# EAGLE design LPC_2TE_3.5 (EAGLE 5.02)
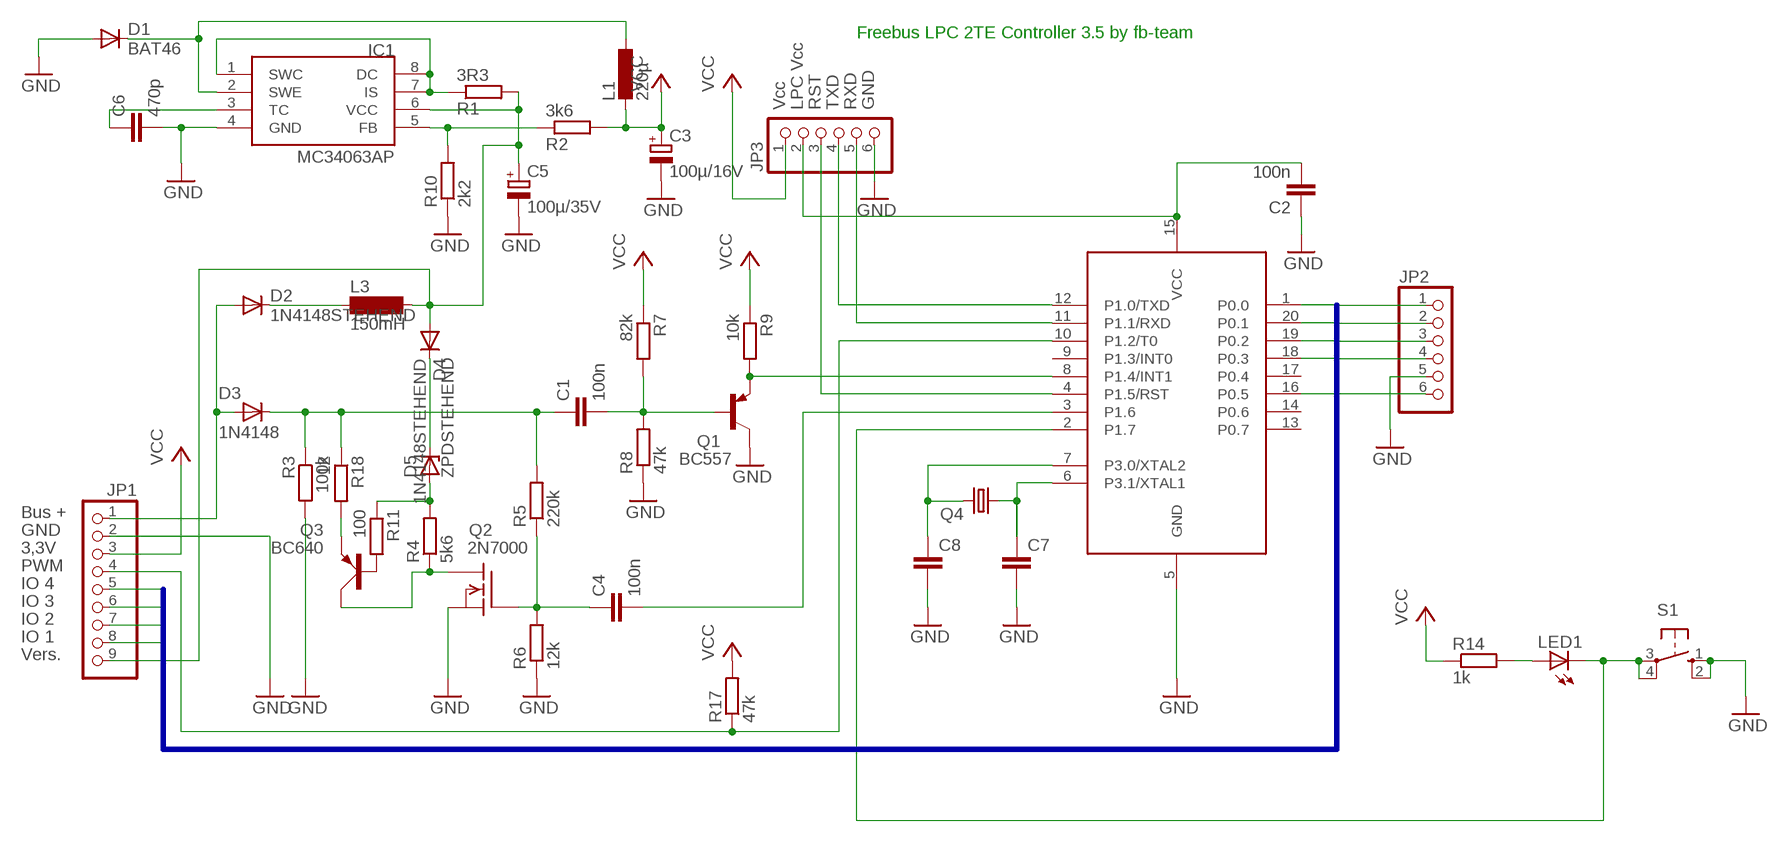
[diagram p0: schematic, sheet 1]

## Parts
C1  100n  C-EU025-024X044  [C025-024X044]
C2  100n  C-EU050-024X044  [C050-024X044]
C3  100µ/16V  CPOL-EUE3.5-8  [E3,5-8]
C4  100n  C-EU025-024X044  [C025-024X044]
C5  100µ/35V  CPOL-EUE3.5-8  [E3,5-8]
C6  470p  C-EU025-024X044  [C025-024X044]
C7  C-EU025-024X044  [C025-024X044]
C8  C-EU025-024X044  [C025-024X044]
D1  BAT46  BAT81  [DO34-7]
D2  1N4148STEHEND  [D-2.5]
D3  1N4148  DO35-STEHEND  [DO35-S]
D4  1N4148STEHEND  [D-2.5]
D5  ZPDSTEHEND  [ZDIODE]
IC1  MC34063AP  [DIL08]
JP1  PINHD-1X9  [1X09]
JP2  PINHD-1X6  [1X06]
JP3  PINHD-1X6  [1X06]
L1  220µ  L-EU0207/2V  [0207/2V]
L3  150mH  BS11  [BS11]
LED1  LED3MM  [LED3MM]
Q1  BC557  [TO92]
Q2  2N7000  VN2222KM  [TO237]
Q3  BC640  [SOT54D]
Q4  CRYSTALHC49S  [HC49/S]
R1  3R3  R-EU_0207/2V  [0207/2V@1]
R2  3k6  R-EU_0207/2V  [0207/2V@1]
R3  100k  R-EU_0207/2V  [0207/2V@1]
R4  5k6  R-EU_0207/2V  [0207/2V@1]
R5  220k  R-EU_0207/2V  [0207/2V@1]
R6  12k  R-EU_0207/2V  [0207/2V@1]
R7  82k  R-EU_0207/2V  [0207/2V@1]
R8  47k  R-EU_0207/2V  [0207/2V@1]
R9  10k  R-EU_0207/2V  [0207/2V@1]
R10  2k2  R-EU_0207/2V  [0207/2V@1]
R11  100  R-EU_0207/2V  [0207/2V@1]
R14  1k  R-EU_0207/2V  [0207/2V@1]
R17  47k  R-EU_0207/2V  [0207/2V@1]
R18  12  R-EU_0207/2V  [0207/2V@1]
S1  10-XX  [B3F-10XX]
U1  89LPC922  [DIL20]

## Nets
EIB+: D2.A D3.P$1(A) JP1.1
GND: C2.1 C3.- C5.- C6.2 C7.2 C8.2 D1.A IC1.4(GND) JP1.2 JP2.5 JP3.6 Q1.3(C) Q2.3(S) R3.2 R6.1 R8.1 R10.1 S1.1(S) S1.2(S1) U1.5(GND)
N$1: Q1.1(E) R9.2 U1.8(P1.4/INT1)
N$2: C1.2 Q1.2(B) R7.2 R8.2
N$3: C8.1 Q4.2 U1.7(P3.0/XTAL2)
N$4: C1.1 D3.P$2(B) R3.1 R5.2 R18.1
N$5: C4.2 U1.3(P1.6)
N$6: C7.1 Q4.1 U1.6(P3.1/XTAL1)
N$7: LED1.K(C) S1.3(P) S1.4(P1) U1.2(P1.7)
N$8: IC1.1(SWC) IC1.7(IS) IC1.8(DC) R1.1
N$9: LED1.A R14.2
N$10: C5.+ D4.A IC1.6(VCC) JP1.9 L3.2 R1.2
N$11: IC1.5(FB) R2.1 R10.2
N$12: D1.C IC1.2(SWE) L1.1
N$13: D2.C L3.1
N$14: C6.1 IC1.3(TC)
N$15: D4.C D5.C
N$25: D5.A R4.2 R11.1
N$26: Q2.1(D) Q3.C R4.1
N$28: Q3.B R11.2
N$29: JP3.4 U1.12(P1.0/TXD)
N$30: JP3.5 U1.11(P1.1/RXD)
N$31: JP3.3 U1.4(P1.5/RST)
N$32: C2.2 JP3.2 U1.15(VCC)
N$33: Q3.E R18.2
N$34: C4.1 Q2.2(G) R5.1 R6.2
N$42: JP2.6 U1.16(P0.5)
P0.0: JP1.8 JP2.1 U1.1(P0.0)
P0.1: JP1.7 JP2.2 U1.20(P0.1)
P0.2: JP1.6 JP2.3 U1.19(P0.2)
P0.3: JP1.5 JP2.4 U1.18(P0.3)
PWM: JP1.4 R17.1 U1.10(P1.2/T0)
VCC: C3.+ JP1.3 JP3.1 L1.2 R2.2 R7.1 R9.1 R14.1 R17.2
Unconnected: U1.9(P1.3/INT0) U1.13(P0.7) U1.14(P0.6) U1.17(P0.4)

## Buses
P0.[0..3]

## Notes on the sheet
- Freebus LPC 2TE Controller 3.5 by fb-team
- Vcc | LPC Vcc | RST | TXD | RXD | GND
- Bus +
- GND
- 3,3V
- PWM
- IO 4
- IO 3
- IO 2
- IO 1
- Vers.

## Library data of the parts
C1 C2 C4 C6-C8 = rcl:C-EU: CAPACITOR, European symbol
C3 C5 = rcl:CPOL-EU: POLARIZED CAPACITOR, European symbol
D1 = diode:BAT81: DIODE barrier diode
D2 D4 = diode:1N4148: DIODE high speed (Philips)
D3 = kubi:DO35-STEHEND
D5 = diode:ZPD: Z DIODE 500 mW
IC1 = mc34063:MC34063
JP1 = pinhead:PINHD-1X9: PIN HEADER
JP2 JP3 = pinhead:PINHD-1X6: PIN HEADER
L1 = rcl:L-EU: INDUCTOR, European symbol
L3 = inductor-neosid:BS: INDUCTOR nominal inductance, magnetically screened
LED1 = led:LED: LED OSRAM: - CHIPLED LG R971, LG N971, LY N971, LG Q971, LY Q971, LO R971, LY R971 LH N974, LH R974 LS Q976, LO Q976, LY Q976 LO Q996 - Hyper CHIPLED LW Q18S LB Q993, LB Q99A, LB R99A - SideLED LS A670, LO A670, LY A670, LG A670, LP A670 LB A673, LV A673, LT A673, LW A673 LH A674 LY A675 LS A676, LA A676, LO A676, LY A676, LW A676 LS A679, LY A679, LG A679 - Hyper Micro SIDELED® LS Y876, LA Y876, LO Y876, LY Y876 LT Y87S - SmartLED LW L88C, LW L88S LB L89C, LB L89S, LG L890 LS L89K, LO L89K, LY L89K LS L896, LA L896, LO L896, LY L896 - TOPLED LS T670, LO T670, LY T670, LG T670, LP T670 LSG T670, LSP T670, LSY T670, LOP T670, LYG T670 LG T671, LOG T671, LSG T671 LB T673, LV T673, LT T673, LW T673 LH T674 LS T676, LA T676, LO T676, LY T676, LB T676, LH T676, LSB T676, LW T676 LB T67C, LV T67C, LT T67C, LS T67K, LO T67K, LY T67K, LW E67C LS E67B, LA E67B, LO E67B, LY E67B, LB E67C, LV E67C, LT E67C LW T67C LS T679, LY T679, LG T679 LS T770, LO T770, LY T770, LG T770, LP T770 LB T773, LV T773, LT T773, LW T773 LH T774 LS E675, LA E675, LY E675, LS T675 LS T776, LA T776, LO T776, LY T776, LB T776 LHGB T686 LT T68C, LB T68C - Hyper Mini TOPLED® LB M676 - Mini TOPLED Santana® LG M470 LS M47K, LO M47K, LY M47K Source: http://www.osram.convergy.de - LUMILED® LXK2-PW12-R00, LXK2-PW12-S00, LXK2-PW14-U00, LXK2-PW14-V00 LXK2-PM12-R00, LXK2-PM12-S00, LXK2-PM14-U00 LXK2-PE12-Q00, LXK2-PE12-R00, LXK2-PE12-S00, LXK2-PE14-T00, LXK2-PE14-U00 LXK2-PB12-K00, LXK2-PB12-L00, LXK2-PB12-M00, LXK2-PB14-N00, LXK2-PB14-P00, LXK2-PB14-Q00 LXK2-PR12-L00, LXK2-PR12-M00, LXK2-PR14-Q00, LXK2-PR14-R00 LXK2-PD12-Q00, LXK2-PD12-R00, LXK2-PD12-S00 LXK2-PH12-R00, LXK2-PH12-S00 LXK2-PL12-P00, LXK2-PL12-Q00, LXK2-PL12-R00 Source: www.luxeon.com
Q1 = transistor-pnp:BC557: PNP Transistor
Q2 = transistor-fet:VN2222KM: N-Channel Enhancement MOSFET (VMOS); 60V; 0,5A; 7,5Ohm
Q3 = transistor-small-signal:BC640: PNP TRANSISTOR
Q4 = crystal:CRYSTAL: CRYSTAL
R1-R11 R14 R17 R18 = rcl:R-EU_: RESISTOR, European symbol
S1 = switch-omron:10-XX: OMRON SWITCH
U1 = micro-philips:89LPC922

## Board
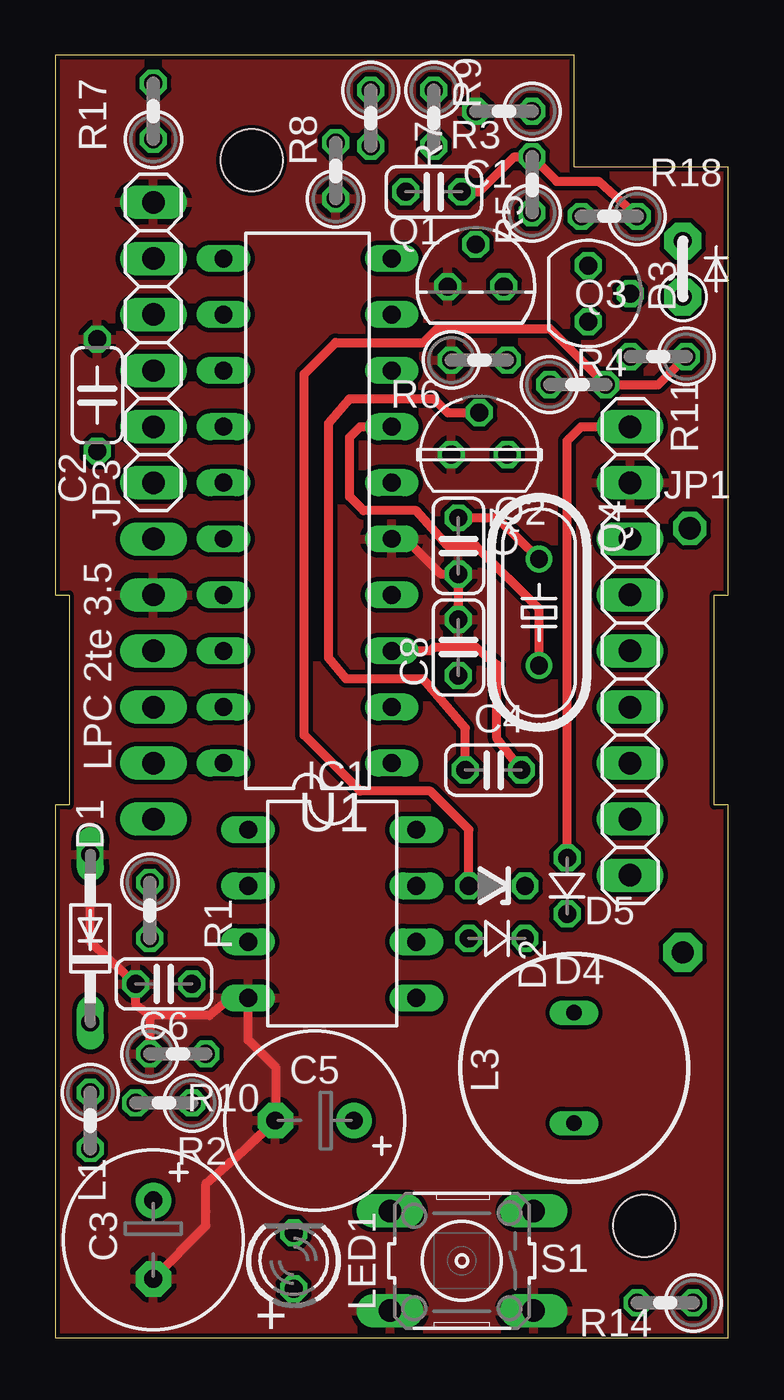
[diagram p1: board, top side]
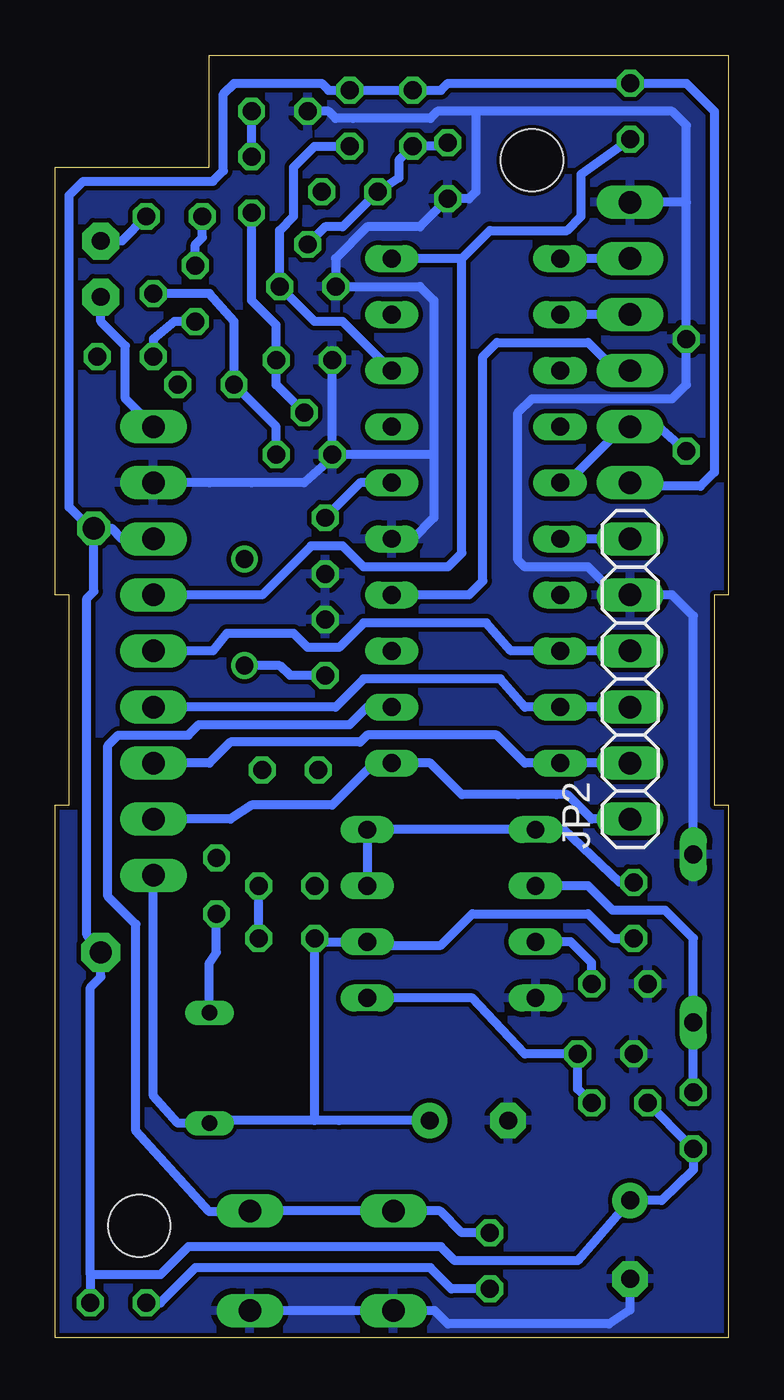
[diagram p2: board, bottom side, seen from below]

Size 30.48 x 58.1 mm. Coordinates in mm from the lower left corner, seen from the top.
Outline: 0,0 30.48,0 30.48,24.13 29.84,24.13 29.84,33.66 30.48,33.66 30.48,53.02 23.49,53.02 23.49,58.1 0,58.1 0,33.66 0.63,33.66 0.63,24.13 0,24.13 0,0
Copper layers (1*16): Top 0.035mm / dielectric 1.5mm / Bottom 0.035mm
Design rules "ZWILLING": minimum track width 0.2mm, minimum drill 0.5mm, track to track 0.2mm, track to pad 0.2mm, pad to pad 0.2mm, via to via 0.2mm, smd to smd 0mil, copper to edge 0.2mm, drill to drill 0.2mm, minimum pad ring 0.2mm, minimum via ring 0.2mm, stop-mask expansion 0.1mm, vias tented up to drill 0mil, thermal gap 10mil
Holes 2.8 mm at 26.67,5.08 8.89,53.34

### Footprints (pad centres in the part's own frame; a part is rotated, then mirrored left to right if it is on the bottom)
C025-024X044 = drill 0.813 octagon: 1 -1.27,0; 2 1.27,0
C050-024X044 = drill 0.813 octagon: 1 -2.54,0; 2 2.54,0
E3,5-8 = drill 0.813 pad 1.6 round: + -1.778,0 | drill 0.813 pad 1.6 octagon: - 1.778,0
DO34-7 = drill 0.813 long: A 3.81,0; C -3.81,0
D-2.5 = drill 0.813 octagon: A 1.27,0; C -1.27,0
DO35-S = drill 0.8 pad 1.676 octagon: P$1 -1.27,0; P$2 1.27,0
ZDIODE = drill 0.813 octagon: A 1.27,0; C -1.27,0
DIL08 = drill 0.813 long: 1 -3.81,-3.81; 2 -1.27,-3.81; 3 1.27,-3.81; 4 3.81,-3.81; 5 3.81,3.81; 6 1.27,3.81; 7 -1.27,3.81; 8 -3.81,3.81
1X09 = drill 1.016 long: 1 -10.16,0; 2 -7.62,0; 3 -5.08,0; 4 -2.54,0; 5 0,0; 6 2.54,0; 7 5.08,0; 8 7.62,0; 9 10.16,0
1X06 = drill 1.016 long: 1 -6.35,0; 2 -3.81,0; 3 -1.27,0; 4 1.27,0; 5 3.81,0; 6 6.35,0
0207/2V = drill 0.813 octagon: 1 -1.27,0; 2 1.27,0
BS11 = drill 0.7 long: 1 -2.5,0; 2 2.5,0
LED3MM = drill 0.813 octagon: A -1.27,0; K 1.27,0
TO92 = drill 0.813 octagon: 1 1.27,0; 2 0,1.905; 3 -1.27,0
TO237 = drill 0.813 octagon: 1 1.27,0; 2 0,1.905; 3 -1.27,0
SOT54D = drill 0.813 octagon: B 1.27,0; C 0,1.905; E -1.27,0
HC49/S = drill 0.813 round: 1 -2.413,0; 2 2.413,0
0207/2V@1 = drill 0.813 octagon: 1 -1.27,0; 2 1.27,0
B3F-10XX = drill 1.016 long: 1 -3.251,2.261; 2 3.251,2.261; 3 -3.251,-2.261; 4 3.251,-2.261
DIL20 = drill 0.813 long: 1 -11.43,-3.81; 2 -8.89,-3.81; 3 -6.35,-3.81; 4 -3.81,-3.81; 5 -1.27,-3.81; 6 1.27,-3.81; 7 3.81,-3.81; 8 6.35,-3.81; 9 8.89,-3.81; 10 11.43,-3.81; 11 11.43,3.81; 12 8.89,3.81; 13 6.35,3.81; 14 3.81,3.81; 15 1.27,3.81; 16 -1.27,3.81; 17 -3.81,3.81; 18 -6.35,3.81; 19 -8.89,3.81; 20 -11.43,3.81

### Placement (x,y rotation side)
C1  17.15,51.91 180 top
C2  1.91,42.7 270 top
C3  4.45,4.44 270 top
C4  19.84,25.72 0 top
C5  11.75,9.84 180 top
C6  4.92,16.03 180 top
C7  18.26,35.88 270 top
C8  18.26,31.27 90 top
D1  1.59,18.1 90 top
D2  23.18,20.48 90 top
D3  28.42,48.42 90 top
D4  20,18.1 180 top
D5  20,20.48 180 top
IC1  12.54,19.21 270 top
JP1  26.04,31.11 270 top
JP2  4.45,29.85 90 bottom
JP3  4.45,45.08 90 top
L1  1.59,9.84 270 top
L3  23.49,12.22 270 top
LED1  10.8,3.49 90 top
Q1  19.05,47.62 0 top
Q2  19.21,40 0 top
Q3  24.13,47.31 270 top
Q4  21.91,32.86 270 top
R1  4.29,19.37 270 top
R2  4.92,10.64 180 top
R3  20.32,55.56 180 top
R4  23.65,43.18 0 top
R5  21.59,52.23 90 top
R6  19.21,44.29 0 top
R7  14.29,55.24 270 top
R8  12.7,52.86 90 top
R9  17.15,55.24 270 top
R10  5.56,12.86 0 top
R11  27.3,44.45 180 top
R14  27.62,1.59 180 top
R17  4.45,55.56 90 top
R18  25.08,50.8 180 top
S1  18.42,3.49 180 top
U1  11.43,37.47 90 top

### Tracks (layer width: path | path; a pad name or v marks a point on that pad's centre or on a via)
EIB+
  Top 0.406: JP1.1 23.81,41.28 23.18,40.64 23.18,24.77 D2.A
  Bottom 0.406: D3.P$1 28.42,46.04 27.3,44.93 27.3,42.55 JP1.1
GND
  Top 0.406: U1.5 15.88,36.2 17.46,34.61 C7.2 C8.2 | 8.26,8.26 C5.- | 8.26,8.26 6.83,6.99 6.83,5.72 6.83,5.08 C3.- | 8.26,8.26 10,9.84 10,12.22 8.73,13.49 IC1.4 | D1.A | C6.2 1.59,17.94 D1.A | C6.2 | 4.29,14.61 3.65,15.08 C6.2 | R10.1 | 4.29,14.61 R10.1 | 4.29,14.61 6.98,14.61 7.94,15.4 IC1.4 | IC1.4 | IC1.4
  Bottom 0.406: 13.33,40.01 Q2.3 | 13.33,40.01 13.33,46.99 13.97,47.63 Q1.3 17.78,48.9 16.35,50.32 13.97,50.32 R8.1 11.75,51.59 11.43,51.91 11.43,55.56 | U1.5 14.29,36.2 13.33,37.15 13.33,40.01 | Q2.3 R6.1 | C2.1 1.9,43.18 2.54,42.55 8.89,42.55 9.52,41.91 9.52,35.24 9.21,34.93 6.35,34.93 5.08,33.66 JP2.5 2.86,33.66 2.54,33.66 1.59,32.7 D1.A | C2.1 1.9,51.44 | 1.9,51.44 JP3.6 | 11.43,55.56 2.54,55.56 1.9,54.93 1.91,54.93 1.91,51.44 1.9,51.44 | U1.5 | 17.78,40.01 19.21,38.74 21.59,38.74 23.49,38.74 24.61,38.74 JP1.2 | 4.44,2.7 C3.- 4.44,1.27 5.4,0.64 12.7,0.64 13.3,1.23 S1.2 21.59,1.23 | 18.1,55.56 17.78,55.25 16.99,55.25 | 18.1,55.56 | 18.1,55.56 R3.2 | 16.99,55.25 13.49,55.25 13.18,55.56 11.43,55.56 | 16.99,55.25 | C2.1 2.06,45.24 C2.1 | D1.A | D1.A | 21.59,1.23 S1.1 | 21.59,1.23 21.59,1.27 | 17.78,40.01 | Q2.3 17.78,40.01 | 17.78,40.01
  pour Bottom: 0,58.1 23.5,58.1 23.5,53.02 30.48,53.02 30.48,33.65 29.85,33.65 29.85,24.13 30.48,24.13 30.48,0 0,0 0,24.13 0.64,24.13 0.64,33.65 0,33.65
  pour Top: 0,58.1 23.5,58.1 23.5,53.02 30.48,53.02 30.48,33.65 29.85,33.65 29.85,24.13 30.48,24.13 30.48,0 0,0 0,24.13 0.64,24.13 0.64,33.65 0,33.65
N$1
  Bottom 0.406: U1.8 17.46,46.04 18.73,46.04 Q1.1 20.32,50.17 19.68,50.8 19.68,53.02 18.73,53.98 R9.2
N$2
  Bottom 0.406: R8.2 12.86,53.98 R7.2 14.92,53.34 14.92,53.02 14.92,52.55 C1.2 16.51,51.28 17.46,50.32 18.26,50.32 Q1.2
N$3
  Top 0.406: U1.7 13.97,41.28 13.81,41.28 13.34,40.8 13.34,38.1 13.97,37.47 16.35,37.47 17.78,35.88 19.05,35.88 21.91,33.02 Q4.2
  Bottom 0.406: Q4.2 20.32,30.45 19.84,30 C8.1
N$4
  Top 0.406: C1.1 19.21,51.91 20.8,53.5 R5.2 22.7,52.39 24.61,52.39 R18.1
  Bottom 0.406: R5.2 R3.1 | D3.P$2 27.46,49.69 R18.1
N$5
  Top 0.406: C4.2 20,27.15 20,30.48 19.05,31.27 18.89,31.27 17.15,31.27 16.99,31.12 U1.3
N$6
  Top 0.406: Q4.1 20,37.15 C7.1
  Bottom 0.406: U1.6 16.67,38.74 C7.1
N$7
  Bottom 0.406: LED1.K 12.06,4.76 13.06,5.75 S1.4 15.16,5.96 15.24,6.03 15.52,5.75 S1.3 21.63,5.75 21.59,5.72 21.75,5.72 23.49,5.72 26.83,9.37 26.83,18.73 28.1,20 28.1,26.83 27.62,27.31 24.45,27.31 23.97,27.78 17.15,27.78 16.35,28.58 15.88,28.58 U1.2
N$8
  Bottom 0.406: IC1.8 | IC1.7 | IC1.8 IC1.7 | IC1.1 8.26,23.02 | IC1.1 IC1.8 | 8.26,23.02 | IC1.1 7.46,23.02 4.92,20.64 4.45,20.64 R1.1
N$9
  Bottom 0.406: LED1.A 12.54,2.22 13.49,3.18 24.13,3.18 25.72,1.59 R14.2
N$10
  Bottom 0.406: R1.2 5.24,18.1 6.35,19.21 11.59,19.21 13.02,17.78 16.35,17.78 IC1.6 | JP1.9 26.04,10.95 24.92,9.72 L3.2 | IC1.6 | IC1.6 19.05,17.94 D4.A | D4.A | 18.73,9.84 D4.A | L3.2 23.49,9.84 18.73,9.84 | L3.2 | C5.+ 17.62,9.84 18.73,9.84
N$11
  Bottom 0.406: IC1.5 11.59,15.4 9.21,12.86 R10.2 | R10.2 | R10.2 | R10.2 6.83,11.27 R2.1 | R2.1 | R2.1
N$12
  Bottom 0.406: IC1.2 6.35,20.48 5.24,19.37 2.86,19.37 1.59,18.1 D1.C | D1.C | D1.C | L1.1 1.59,11.27 D1.C
N$13
  Bottom 0.406: L3.1 | L3.1 23.49,16.99 23.18,17.46 D2.C | D2.C
N$14
  Bottom 0.406: C6.1 | 7.14,17.94 6.19,16.99 C6.1 | 7.14,17.94 | 7.14,17.94 IC1.3
N$15
  Bottom 0.406: D4.C D5.C | D4.C | D4.C 21.43,18.1
N$25
  Top 0.406: R11.1 27.3,43.18 R4.2 | D5.A 18.73,23.02 16.99,24.77 | 16.99,24.77 | 16.99,24.77 13.81,24.77 11.27,27.31 11.27,43.66 12.7,45.09 16.67,45.09 17.3,45.72 22.38,45.72 R4.2 | R4.2
N$26
  Bottom 0.406: Q3.C 23.49,47.31 22.38,46.04 R4.1 | Q2.1 20.48,41.28 R4.1 | R4.1
N$28
  Bottom 0.406: R11.2 26.03,45.24 25.08,46.04 Q3.B
N$29
  Bottom 0.406: JP3.4 U1.12
N$30
  Bottom 0.406: JP3.5 U1.11
N$31
  Bottom 0.406: U1.4 11.75,33.66 11.11,34.29 11.11,44.45 10.48,45.09 6.35,45.09 5.08,43.82 JP3.3
N$32
  Bottom 0.406: U1.15 7.3,38.74 4.76,41.28 JP3.2 3.18,41.28 C2.2
N$33
  Bottom 0.406: Q3.E 24.13,49.53 23.81,49.85 R18.2
N$34
  Top 0.406: 13.34,42.55 12.38,41.43 12.38,30.8 13.18,29.85 16.67,29.85 18.57,27.62 C4.1 | 13.34,42.55 | 13.34,42.55 17.15,42.55 17.78,41.91 Q2.2
  Bottom 0.406: Q2.2 20.48,43.18 R6.2 20.48,45.88 21.59,46.99 R5.1
N$42
  Bottom 0.406: U1.16 | U1.16 | JP2.6 U1.16
P0.0
  Bottom 0.406: 9.52,24.61 7.78,24.61 7.3,24.61 6.19,23.5 JP2.1 | JP2.1 | JP1.8 22.54,23.5 21.59,24.13 17.94,24.13 16.03,26.04 U1.1 | 9.52,24.61 12.06,24.61 13.49,26.04 U1.1 | 9.52,24.61 | U1.1
P0.1
  Bottom 0.406: JP2.2 U1.20 7.78,26.04 | JP1.7 23.49,26.04 22.54,26.99 16.67,26.99 16.35,27.31 10.48,27.31 9.21,26.04 7.78,26.04 | 7.78,26.04
P0.2
  Bottom 0.406: JP2.3 U1.19 | JP1.6 17.78,28.58 16.51,29.85 10.32,29.85 9.21,28.58 U1.19 | U1.19 | U1.19
P0.3
  Bottom 0.406: JP1.5 23.34,31.12 22.7,31.91 19.69,31.91 19.05,31.27 17.62,31.27 16.51,32.39 11.27,32.39 10.95,32.39 9.84,31.12 U1.18 JP2.4
PWM
  Bottom 0.406: 12.06,48.9 12.06,35.56 12.7,34.93 16.51,34.93 17.46,35.88 18.89,35.88 21.11,33.66 22.86,33.66 JP1.4 | 12.06,48.9 U1.10 | 12.06,48.9 10.79,50.17 7.3,50.17 6.67,50.8 6.67,52.71 R17.1
VCC  (via drill 1, 1 pad 1.78)
  Bottom 0.406: JP3.1 4.29,38.58 3.17,38.58 1.27,38.58 0.63,39.21 0.63,55.56 1.9,56.83 R17.2 | R17.2 12.7,56.83 13.02,56.52 R7.1 R9.1 18.1,56.52 18.42,56.83 22.38,56.83 22.86,56.36 22.86,52.86 23.34,52.39 29.21,52.39 29.84,51.75 29.84,37.62 29.05,36.83 29.05,36.51 v28.73,36.67 | 28.89,2.86 R14.1 | 28.89,2.86 25.72,2.86 24.45,4.13 13.02,4.13 12.38,3.49 6.83,3.49 C3.+ 3.02,6.22 1.59,7.62 L1.2 | v28.73,36.67 27.94,36.67 27.46,36.2 JP1.3 | v28.73,36.67 28.73,33.81 29.05,33.5 29.05,18.26 v28.42,17.46 28.42,16.35 28.89,15.88 28.89,2.86 | v28.73,36.67 29.05,36.35 29.21,36.51 | R17.2 | R2.2 1.75,8.73 L1.2 | L1.2 | 28.89,2.86 | 28.89,2.86 | L1.2 | L1.2

### Text on the board
tPlace: +
tNames: LPC 2te 3.5